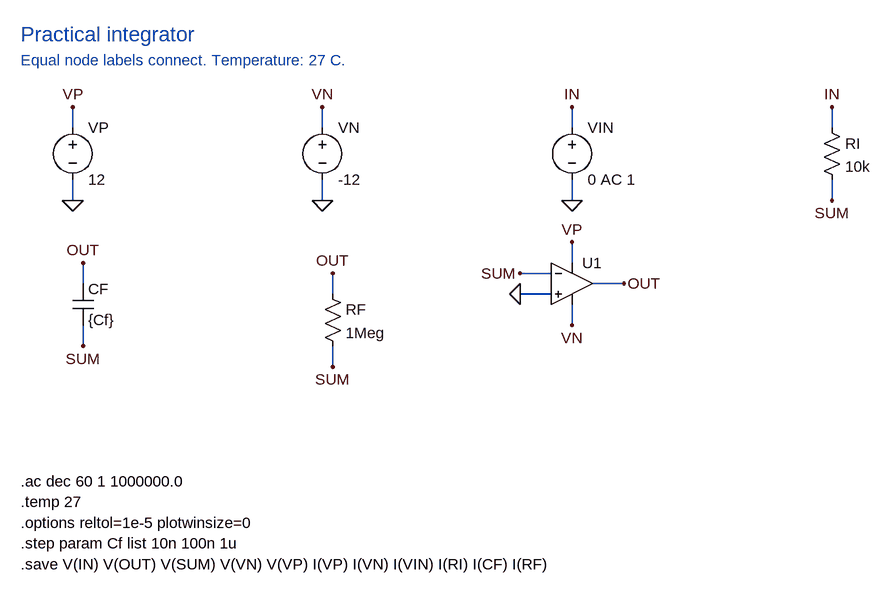
[diagram p0: schematic opamp-integrator.asc]
opamp-integrator.asc, the LTspice schematic file:
Version 4
SHEET 1 1740 1000
WIRE 144 176 144 144
WIRE 144 256 144 288
WIRE 528 176 528 144
WIRE 528 256 528 288
WIRE 912 176 912 144
WIRE 912 256 912 288
WIRE 1312 176 1312 144
WIRE 1312 256 1312 288
WIRE 160 416 160 384
WIRE 160 480 160 512
WIRE 544 432 544 400
WIRE 544 512 544 544
WIRE 880 432 832 432
WIRE 880 400 832 400
WIRE 912 384 912 352
WIRE 912 448 912 480
WIRE 944 416 992 416
FLAG 144 144 VP
FLAG 144 288 0
FLAG 528 144 VN
FLAG 528 288 0
FLAG 912 144 IN
FLAG 912 288 0
FLAG 1312 144 IN
FLAG 1312 288 SUM
FLAG 160 384 OUT
FLAG 160 512 SUM
FLAG 544 400 OUT
FLAG 544 544 SUM
FLAG 832 432 0
FLAG 832 400 SUM
FLAG 912 352 VP
FLAG 912 480 VN
FLAG 992 416 OUT
SYMBOL voltage 144 160 R0
SYMATTR InstName VP
SYMATTR Value 12
SYMBOL voltage 528 160 R0
SYMATTR InstName VN
SYMATTR Value -12
SYMBOL voltage 912 160 R0
SYMATTR InstName VIN
SYMATTR Value 0 AC 1
SYMBOL res 1296 160 R0
SYMATTR InstName RI
SYMATTR Value 10k
SYMBOL cap 144 416 R0
SYMATTR InstName CF
SYMATTR Value {Cf}
SYMBOL res 528 416 R0
SYMATTR InstName RF
SYMATTR Value 1Meg
SYMBOL OpAmps/UniversalOpamp2 912 416 R0
SYMATTR InstName U1
SYMATTR SpiceModel level2
SYMATTR Value2 Avol=1Meg GBW=10Meg Slew=10Meg
SYMATTR SpiceLine Ilimit=100m Rail=0.5 Vos=0
SYMATTR SpiceLine2 En=0 Enk=0 In=0 Ink=0 Rin=1G
TEXT 64 32 Left 3 ;Practical integrator
TEXT 64 72 Left 2 ;Equal node labels connect. Temperature: 27 C.
TEXT 64 720 Left 2 !.ac dec 60 1 1000000.0
TEXT 64 752 Left 2 !.temp 27
TEXT 64 784 Left 2 !.options reltol=1e-5 plotwinsize=0
TEXT 64 816 Left 2 !.step param Cf list 10n 100n 1u
TEXT 64 848 Left 2 !.save V(IN) V(OUT) V(SUM) V(VN) V(VP) I(VP) I(VN) I(VIN) I(RI) I(CF) I(RF)

The netlist it stands for:
* opamp-integrator.asc
VP VP 0 12
VN VN 0 -12
VIN IN 0 0 AC 1
RI IN SUM 10k
CF OUT SUM {Cf}
RF OUT SUM 1Meg
XU1 0 SUM VP VN OUT level2 Avol=1Meg GBW=10Meg Slew=10Meg Ilimit=100m Rail=0.5 Vos=0 En=0 Enk=0 In=0 Ink=0 Rin=1G  ; pins In+ In- V+ V- OUT
* Practical integrator
* Equal node labels connect. Temperature: 27 C.
.ac dec 60 1 1000000.0
.temp 27
.options reltol=1e-5 plotwinsize=0
.step param Cf list 10n 100n 1u
.save V(IN) V(OUT) V(SUM) V(VN) V(VP) I(VP) I(VN) I(VIN) I(RI) I(CF) I(RF)
.lib UniversalOpAmp2.lib
.backanno
.end